# Altium schematic sheet Driver&Converter.SchDoc
size A4
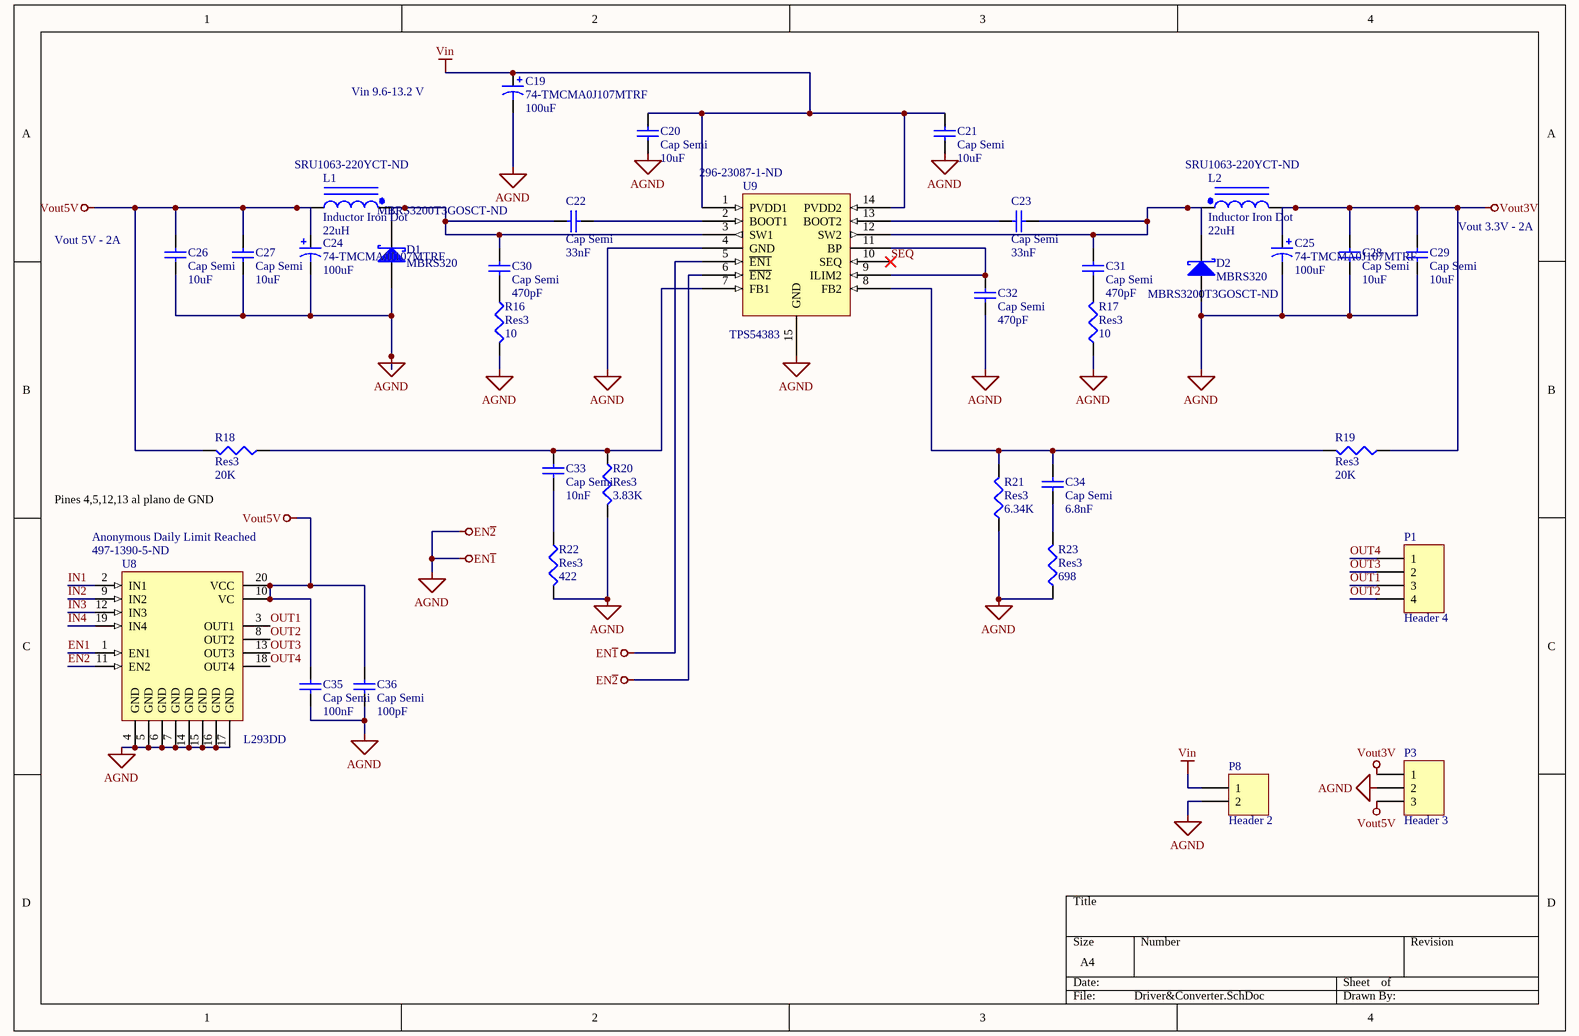
[diagram p0: Driver&Converter.SchDoc]

## Parts
C19  74-TMCMA0J107MTRF  value 100uF  [C1206]
C20  Cap Semi  value 10uF  [C1206]
C21  Cap Semi  value 10uF  [C1206]
C22  Cap Semi  value 33nF  [C1206]
C23  Cap Semi  value 33nF  [C1206]
C24  74-TMCMA0J107MTRF  value 100uF  [C1206]
C25  74-TMCMA0J107MTRF  value 100uF  [C1206]
C26  Cap Semi  value 10uF  [C1206]
C27  Cap Semi  value 10uF  [C1206]
C28  Cap Semi  value 10uF  [C1206]
C29  Cap Semi  value 10uF  [C1206]
C30  Cap Semi  value 470pF  [C1206]
C31  Cap Semi  value 470pF  [C1206]
C32  Cap Semi  value 470pF  [C1206]
C33  Cap Semi  value 10nF  [C1206]
C34  Cap Semi  value 6.8nF  [C1206]
C35  Cap Semi  value 100nF  [C1206]
C36  Cap Semi  value 100pF  [C1206]
D1  MBRS320  Supplier Part Number 1: MBRS3200T3GOSCT-ND  [SMB]
D2  MBRS320  Supplier Part Number 1: MBRS3200T3GOSCT-ND  [SMB]
L1  Inductor Iron Dot  value 22uH  Supplier Part Number 1: SRU1063-220YCT-ND  [DIODE_SMC]
L2  Inductor Iron Dot  value 22uH  Supplier Part Number 1: SRU1063-220YCT-ND  [DIODE_SMC]
P1  Header 4  [HDR1X4]
P3  Header 3  [HDR1X3]
P8  Header 2  [HDR1X2]
R16  Res3  value 10  [J1-0603]
R17  Res3  value 10  [J1-0603]
R18  Res3  value 20K  [J1-0603]
R19  Res3  value 20K  [J1-0603]
R20  Res3  value 3.83K  [J1-0603]
R21  Res3  value 6.34K  [J1-0603]
R22  Res3  value 422  [J1-0603]
R23  Res3  value 698  [J1-0603]
U8  L293DD  Supplier Part Number 1: 497-1390-5-ND  Supplier Part Number 2: Anonymous Daily Limit Reached  [SO20_N]
U9  TPS54383  Supplier Part Number 1: 296-23087-1-ND  [TPS54383_converter]

## Nets
AGND: C19.2 C20.1 C21.1 C24.2 C25.2 C26.1 C27.1 C28.1 C29.1 C32.1 C35.1 C36.1 D1.1(A) D2.1(A) P3.2 P8.2 R16.1 R17.1 R20.1 R21.1 R22.1 R23.1 U8.4(GND) U8.5(GND) U8.6(GND) U8.7(GND) U8.14(GND) U8.15(GND) U8.16(GND) U8.17(GND) U9.4(GND) U9.5(~{EN1}) U9.6(~{EN2}) U9.15(GND)  [also labelled EN~{1}, EN~{2}]
Vin: C19.1 C20.2 C21.2 P8.1 U9.1(PVDD1) U9.14(PVDD2)
Vout3V: C25.1 C28.2 C29.2 L2.2 P3.1 R19.1
Vout5V: C24.1 C26.2 C27.2 C35.2 C36.2 L1.2 P3.3 R18.1 U8.10(VC) U8.20(VCC)
EN1: U8.1(EN1)
EN2: U8.11(EN2)
IN1: U8.2(IN1)
IN2: U8.9(IN2)
IN3: U8.12(IN3)
IN4: U8.19(IN4)
OUT1: P1.3 U8.3(OUT1)
OUT2: P1.4 U8.8(OUT2)
OUT3: P1.2 U8.13(OUT3)
OUT4: P1.1 U8.18(OUT4)
SEQ: U9.10(SEQ)
NetC22_1: C22.1 C30.2 D1.2(K) L1.1 U9.3(SW1)
NetC22_2: C22.2 U9.2(BOOT1)
NetC23_1: C23.1 C31.2 D2.2(K) L2.1 U9.12(SW2)
NetC23_2: C23.2 U9.13(BOOT2)
NetC30_1: C30.1 R16.2
NetC31_1: C31.1 R17.2
NetC32_2: C32.2 U9.9(ILIM2) U9.11(BP)
NetC33_1: C33.1 R22.2
NetC33_2: C33.2 R18.2 R20.2 U9.7(FB1)
NetC34_1: C34.1 R23.2
NetC34_2: C34.2 R19.2 R21.2 U9.8(FB2)

## Notes on the sheet
- Vin 9.6-13.2 V
- (near C26) Vout 5V - 2A
- (near C29) Vout 3.3V - 2A
- (near R18) Pines 4,5,12,13 al plano de GND

## Library data of the parts
C19 C24 C25 = Cap Pol3: Polarized Capacitor (Surface Mount); Published: 8-Jun-2000; LatestRevisionDate: 29-May-2009; LatestRevisionNote: IPC-7351 Footprint Added.; PackageReference: C0805; Publisher: Altium Limited; PackageDescription: Chip Capacitor
C20-C23 C26-C36 = Cap Semi: Capacitor (Semiconductor SIM Model); Published: 8-Jun-2000; LatestRevisionDate: 29-May-2009; LatestRevisionNote: IPC-7351 Footprint Added.; PackageReference: C1206; Publisher: Altium Limited; PackageDescription: Chip Capacitor
D1 D2 = D Schottky: Schottky Diode; Published: 8-Jun-2000; LatestRevisionDate: 17-Jul-2002; LatestRevisionNote: Re-released for DXP Platform.; PackageReference: SMB; Publisher: Altium Limited; PackageDescription: DO-214-AA/SMB; 2 C-Bend Leads; Body 5.3 x 3.6 mm, inc. leads (LxW); Code_JEDEC: DO-214-AA; Supplier 1: Digi-Key
L1 L2 = Inductor Iron Dot: Magnetic-Core Inductor with Winding Polarity Marking; Published: 24-Mar-1999; LatestRevisionDate: 17-Jul-2002; LatestRevisionNote: Re-released for DXP Platform.; PackageReference: DIODE_SMC; Publisher: Altium Limited; PackageDescription: Diode; 2 Leads; Supplier 1: Digi-Key
P1 = Header 4: Header, 4-Pin; LatestRevisionDate: 17-Jul-2002; LatestRevisionNote: Re-released for DXP Platform.; Publisher: Altium Limited
P3 = Header 3: Header, 3-Pin; LatestRevisionDate: 17-Jul-2002; LatestRevisionNote: Re-released for DXP Platform.; Publisher: Altium Limited
P8 = Header 2: Header, 2-Pin; LatestRevisionDate: 17-Jul-2002; LatestRevisionNote: Re-released for DXP Platform.; Publisher: Altium Limited
R16-R23 = Res3: Resistor; Published: 8-Jun-2000; LatestRevisionDate: 29-May-2009; LatestRevisionNote: IPC-7351 Footprint Added.; PackageReference: J1-0603; Publisher: Altium Limited; PackageDescription: Chip Resistor
U8 = L293DD: Push-Pull Four Channel Driver With Diode; Published: 8-Jun-2000; LatestRevisionDate: 13-Apr-2006; LatestRevisionNote: IPC-7351 Footprint Added.; DatasheetVersion: Jun-1996; PackageVersion: Jul-2001; PackageReference: SO20; Publisher: Altium Limited; PackageDescription: 20-Pin Plastic Small Outline Integrated Circuit 1.27 mm Pitch; ComponentLink1Description: Manufacturer Link; ComponentLink1URL: http://www.st.com/; ComponentLink2Description: Datasheet; ComponentLink2URL: http://www.st.com/stonline/products/literature/ds/1330/l293d.pdf; Code_JEDEC: MS-013-AC; Code_IPC: SOIC127P1030-20; Supplier 1: Digi-Key; Supplier 2: Mouser
U9 = TPS54383: Supplier 1: Digi-Key